# EAGLE schematic ME-433-2021 (EAGLE 9.6.2)
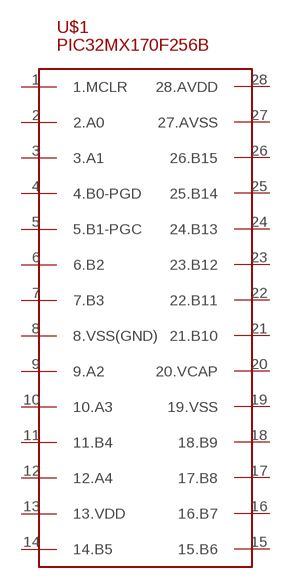
[diagram p0: schematic, sheet 1]

## Parts
U$1  PIC32MX170F256B  [DIL28-3]
Unconnected: U$1.1(1.MCLR) U$1.2(2.A0) U$1.3(3.A1) U$1.4(4.B0-PGD) U$1.5(5.B1-PGC) U$1.6(6.B2) U$1.7(7.B3) U$1.8(8.VSS(GND)) U$1.9(9.A2) U$1.10(10.A3) U$1.11(11.B4) U$1.12(12.A4) U$1.13(13.VDD) U$1.14(14.B5) U$1.15(15.B6) U$1.16(16.B7) U$1.17(17.B8) U$1.18(18.B9) U$1.19(19.VSS) U$1.20(20.VCAP) U$1.21(21.B10) U$1.22(22.B11) U$1.23(23.B12) U$1.24(24.B13) U$1.25(25.B14) U$1.26(26.B15) U$1.27(27.AVSS) U$1.28(28.AVDD)

## Library data of the parts
U$1 = LIBRARY:PIC32MX170F256B